# EAGLE schematic pixel (EAGLE 7.7.0)
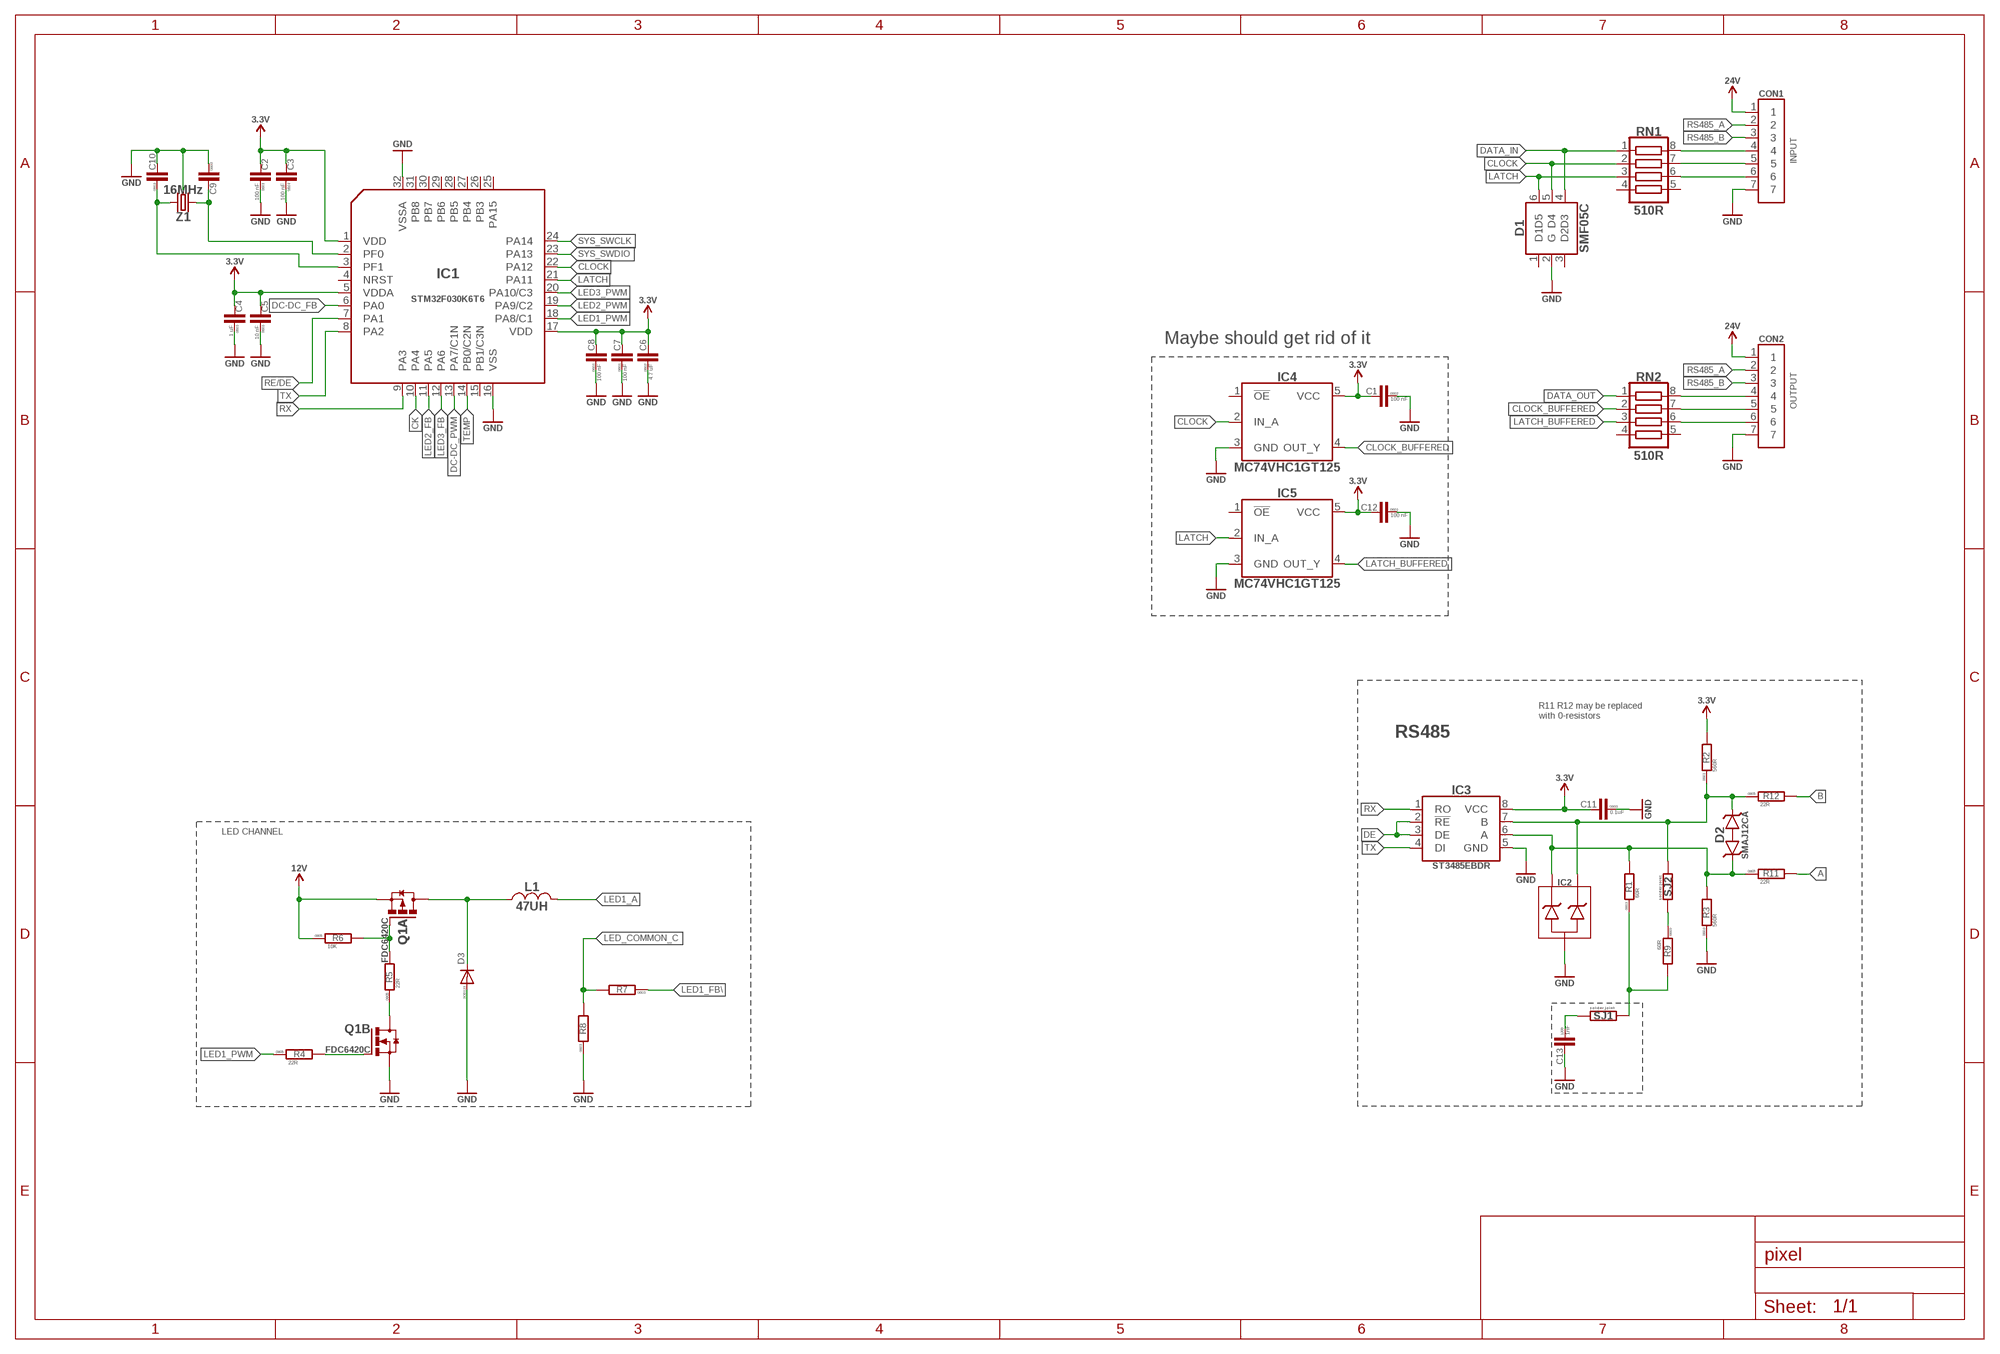
[diagram p0: schematic, sheet 1]

## Parts
C1  100 nF  C-0603  [C0603]
C2  100 nF  C-0603  [C0603]
C3  100 nF  C-0603  [C0603]
C4  1 uF  C-0603  [C0603]
C5  10 nF  C-0603  [C0603]
C6  4.7 uF  C-0603  [C0603]
C7  100 nF  C-0603  [C0603]
C8  100 nF  C-0603  [C0603]
C9  C-0603  [C0603]
C10  C-0603  [C0603]
C11  0.1uF  C-0603  [C0603]
C12  100 nF  C-0603  [C0603]
C13  1nF  C-1206  [C1206]
CON1  DS1066-07M-SIDE  [DS1066-08M_SIDE]
CON2  DS1066-07M-SIDE  [DS1066-08M_SIDE]
D1  SMF05C  [SC70_6L]
D2  SMAJ12A  [SMA]
D3  DIODE-SOD123  [SOD123]
IC1  STM32F030K6TX-LQFP32(7X7)  [LQFP32-7X7]
IC2  ESDA6V1L  [SOT23]
IC3  ST3485SOIC8  [SOIC8]
IC4  MC74VHC1GT125  [SOT23-5]
IC5  MC74VHC1GT125  [SOT23-5]
L1  47UH  SDR0604-470KL  [SDR0604]
Q1  FDC6420C  [SOT23-6]
R1  60R  R-0603  [R0603]
R2  560R  R-0603  [R0603]
R3  560R  R-0603  [R0603]
R4  22R  R-0805  [R0805]
R5  22R  R-0805  [R0805]
R6  10K  R-0805  [R0805]
R7  R-0603  [R0603]
R8  R-0603  [R0603]
R9  60R  R-0603  [R0603]
R11  22R  R-0805  [R0805]
R12  22R  R-0805  [R0805]
RN1  510R  RESISTOR_ARRAY  [CAT16-J4]
RN2  510R  RESISTOR_ARRAY  [CAT16-J4]
SJ1  SOLDER_JOINT  [RES_0]
SJ2  SOLDER_JOINT  [RES_0]
Z1  16MHz  CRYSTAL-3.2X2.5-4P  [OSCILLATOR-3.2X2.5]

## Nets
A: D2.A IC2.2(C1) IC3.6(A) R1.2 R3.2 R11.1 R11.2
B: D2.C IC2.3(C2) IC3.7(B) R2.1 R12.1 R12.2 SJ2.1
CK: IC1.10(PA4)
CLOCK: D1.5(D4) IC1.22(PA12) IC4.2(IN_A) RN1.2
CLOCK_BUFFERED: IC4.4(OUT_Y) RN2.2
DATA_IN: D1.4(D3) RN1.1
DATA_OUT: RN2.1
DC-DC_FB: IC1.6(PA0)
DC-DC_PWM: IC1.13(PA7/C1N)
DE: IC3.2(!RE) IC3.3(DE)
GND: C1.1 C2.1 C3.1 C4.1 C5.1 C6.1 C7.1 C8.1 C9.1 C10.2 C11.1 C12.1 C13.P$2 CON1.7 CON2.7 D1.2(G) D3.A IC1.16(VSS) IC1.32(VSSA) IC2.1(A) IC3.5(GND) IC4.3(GND) IC5.3(GND) Q1.5(B:S) R3.1 R8.1 Z1.2(GND) Z1.4(GND)
LATCH: D1.6(D5) IC1.21(PA11) IC5.2(IN_A) RN1.3
LATCH_BUFFERED: IC5.4(OUT_Y) RN2.3
LED1_A: L1.2
LED1_FB\: R7.1
LED1_PWM: IC1.18(PA8/C1) R4.1
LED2_FB: IC1.11(PA5)
LED2_PWM: IC1.19(PA9/C2)
LED3_FB: IC1.12(PA6)
LED3_PWM: IC1.20(PA10/C3)
LED_COMMON_C: R7.2 R8.2
N$1: C9.2 IC1.2(PF0) Z1.1
N$2: CON1.4 RN1.8
N$3: C10.1 IC1.3(PF1) Z1.3
N$4: CON1.5 RN1.7
N$5: CON1.6 RN1.6
N$6: CON2.4 RN2.8
N$7: Q1.3(A:G) R5.2 R6.2
N$8: R1.1 R9.2 SJ1.1
N$9: CON2.5 RN2.7
N$10: R9.1 SJ2.2
N$11: C13.P$1 SJ1.2
N$12: CON2.6 RN2.6
N$13: Q1.1(B:G) R4.2
N$15: Q1.6(B:D) R5.1
N$17: D3.C L1.1 Q1.2(A:D)
RE/DE: IC1.7(PA1)
RS485_A: CON1.2 CON2.2
RS485_B: CON1.3 CON2.3
RX: IC1.9(PA3) IC3.1(RO)
SYS_SWCLK: IC1.24(PA14)
SYS_SWDIO: IC1.23(PA13)
TEMP: IC1.14(PB0/C2N)
TX: IC1.8(PA2) IC3.4(DI)
VDD_3V3: C1.2 C2.2 C3.2 C4.2 C5.2 C6.2 C7.2 C8.2 C11.2 C12.2 IC1.1(VDD) IC1.5(VDDA) IC1.17(VDD) IC3.8(VCC) IC4.5(VCC) IC5.5(VCC) R2.2 ; supply symbol labelled 3.3V
VDD_12V: Q1.4(A:S) R6.1 ; supply symbol labelled 12V
VDD_24V: CON1.1 CON2.1 ; supply symbol labelled 24V
Unconnected: D1.1(D1) D1.3(D2) IC1.4(NRST) IC1.15(PB1/C3N) IC1.25(PA15) IC1.26(PB3) IC1.27(PB4) IC1.28(PB5) IC1.29(PB6) IC1.30(PB7) IC1.31(PB8) IC4.1(!OE) IC5.1(!OE) RN1.4 RN1.5 RN2.4 RN2.5

## Notes on the sheet
- INPUT
- Maybe should get rid of it
- OUTPUT
- R11 R12 may be replaced 
  with 0-resistors
- RS485
- LED CHANNEL

## Library data of the parts
C1-C12 = rc:C; PACKAGE: 0603
C13 = rc:C; ASSEMBLY: SPECIAL; PACKAGE: 1206
CON1 CON2 = pixel_masterlib:DS1066-07M: https://lib.chipdip.ru/502/DOC001502873.pdf
D1 = pixel_masterlib:SMF05C; DIGIKEY#: SMF05CCT-ND; MANF: Semtech Corporation; MANF#: SMF05C.TCT
D2 = masterlib:SMAJ12A: TVS DIODE 12VWM 19.9VC DO214AC; DIGIKEY#: SMAJ12CABTR-ND; MANF: Bourns Inc; MANF#: SMAJ12CA
D3 = diodes:DIODE; PACKAGE: SOD123
IC1 = pixel_masterlib:STM32F030K6TX: MCU 32BIT 32KB FLASH 32LQFP; DIGIKEY#: 497-14046-ND; MANF: STMicroelectronics; MANF#: STM32F030K6T6
IC2 = pixel_masterlib:ESDA6V1L: TVS DIODE 5.25VWM SOT23; DIGIKEY#: 497-2930-2-ND; MANF: STMicroelectronics; MANF#: ESDA6V1L
IC3 = pixel_masterlib:ST3485: IC TXRX 3.3V RS485/422 8 SOIC; DIGIKEY#: 497-2080-1-ND; MANF: STMicroelectronics; MANF#: ST3485EBDR
IC4 IC5 = pixel_masterlib:MC74VHC1GT125: Buffer, Non-Inverting 1 Element 1 Bit per Element Push-Pull Output 5-TSOP; DIGIKEY#: MC74VHC1GT125DT1GOSDKR-ND; MANF: ON Semiconductor; MANF#: MC74VHC1GT125
L1 = power_inductors:SDR0604; DIGIKEY#: SDR0604-470KLCT-ND; MANF: Bourns Inc; MANF#: SDR0604-470KL
Q1 = pixel_masterlib:FDC6420C: Mosfet Array N and P-Channel 20V 3A, 2.2A 700mW Surface Mount SuperSOT™-6; DIGIKEY#: FDC6420CTR-ND; MANF: Fairchild; MANF#: FDC6420C
R1-R3 R7-R9 = rc:R; PACKAGE: 0603
R4-R6 R11 R12 = rc:R; PACKAGE: 0805
RN1 RN2 = pixel_masterlib:RESISTOR_ARRAY: Chip Resistor Array 4 Single Resistor; DIGIKEY#: CAT16-511J4LF-ND; MANF: Bourns Inc; MANF#: CAT16-511J4LF
SJ1 SJ2 = eth_conv_master_lib:SOLDER_JOINT
Z1 = watchdog_master_library:CRYSTAL: Smd Crystal; DIGIKEY#: 1253-1182-1-ND; MANF: AVX Corp/Kyocera Corp; MANF#: CX3225GB16000P0HPQCC